# Altium schematic sheet pwr.schdoc
size 170 x 77 mm
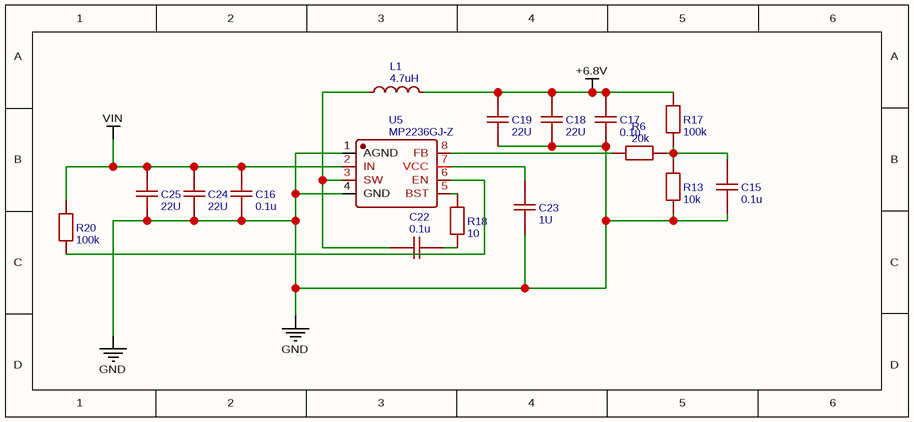
[diagram p0: pwr.schdoc]

## Parts
C15  0.1u  [C0603]
C16  0.1u  [C0603]
C17  0.1u  [C0603]
C18  22U  [C0805]
C19  22U  [C0805]
C22  0.1u  [C0603]
C23  1U  [C0603]
C24  22U  [C0805]
C25  22U  [C0805]
L1  4.7uH  [IND-SMD_L7.1-W6.5]
R6  20k  [R0603]
R13  10k  [R0603]
R17  100k  [R0603]
R18  10  [R0603]
R20  100k  [R0603]
U5  MP2236GJ-Z  [TSOT-23-8_L2.9-W1.6-P0.65-LS2.8-BL]

## Nets
+6.8V: C17.2 C18.2 C19.2 L1.2 R17.2
GND: C15.1 C16.1 C17.1 C18.1 C19.1 C23.1 C24.1 C25.1 R13.1 U5.1(AGND) U5.4(GND)
VIN: C16.2 C24.2 C25.2 R20.2 U5.2(IN)
NetC15_2: C15.2 R6.2 R13.2 R17.1
NetC22_1: C22.1 L1.1 U5.3(SW)
NetC22_2: C22.2 R18.1
NetC23_2: C23.2 U5.7(VCC)
NetR6_1: R6.1 U5.8(FB)
NetR18_2: R18.2 U5.5(BST)
NetR20_1: R20.1 U5.6(EN)

## Library data of the parts
C15-C17 C22 = 0.1u: nameAlias: Value(F); Contributor: LCEDA_Lib; spicePre: C; spiceSymbolName: C_0603_US
C18 C19 C24 C25 = 22U: nameAlias: Value(F); Contributor: LCEDA_Lib; spicePre: C; spiceSymbolName: C_0805_US
C23 = 1U: nameAlias: Value(F); Contributor: LCEDA_Lib; spicePre: C; spiceSymbolName: C_0603_US
L1 = 4.7uH: BOM_Manufacturer: TDK; BOM_Manufacturer Part: SPM6530T-4R7M; nameAlias: Inductance; BOM_Supplier: LCSC; BOM_Supplier Part: C76857; BOM_JLCPCB Part Class: Extended Part; spicePre: L; spiceSymbolName: SPM6530T-4R7M
R6 = 20k: nameAlias: Value(Ω); Contributor: LCEDA_Lib; spicePre: R; spiceSymbolName: R_0603_EU
R13 = 10k: nameAlias: Value(Ω); Contributor: LCEDA_Lib; spicePre: R; spiceSymbolName: R_0603_EU
R17 R20 = 100k: nameAlias: Value(Ω); Contributor: LCEDA_Lib; spicePre: R; spiceSymbolName: R_0603_EU
R18 = 10: nameAlias: Value(Ω); Contributor: LCEDA_Lib; spicePre: R; spiceSymbolName: R_0603_EU
U5 = MP2236GJ-Z: BOM_Manufacturer: null; Contributor: LCSC; BOM_Supplier: LCSC; BOM_Supplier Part: C9900000708; BOM_Manufacturer Part: MP2236GJ-Z; BOM_JLCPCB Part Class: Extended Part; spicePre: U; spiceSymbolName: MP2236GJ-Z